# EAGLE design simple_eq_5532 (EAGLE 6.5.0)
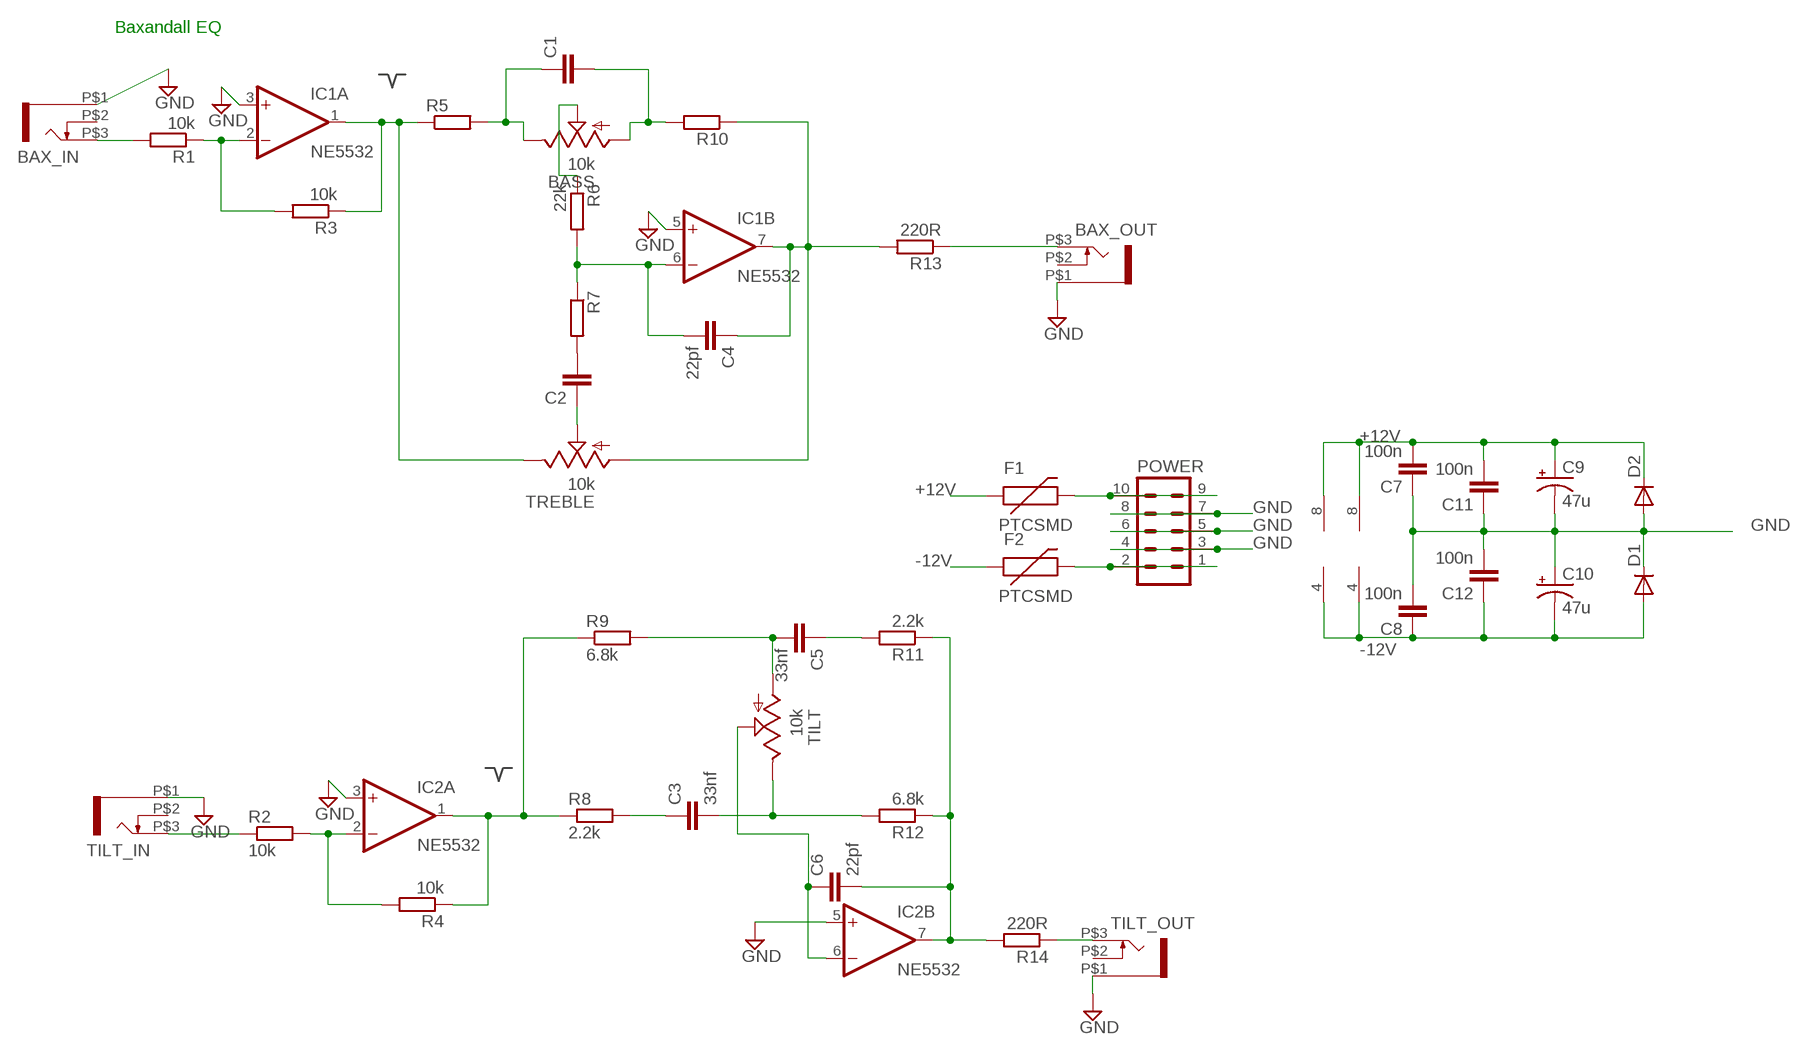
[diagram p0: schematic, sheet 1]

## Parts
BASS  10k  ALPHA-9MMF2A  [EVUF]
BAX_IN  THONKICONN  [THONKICONN]
BAX_OUT  THONKICONN  [THONKICONN]
C1  C-EU0805_CAP  [R0805]
C2  C-EU0805_CAP  [R0805]
C3  33nf  C-EU0805_CAP  [R0805]
C4  22pf  C-EU0805_CAP  [R0805]
C5  33nf  C-EU0805_CAP  [R0805]
C6  22pf  C-EU0805_CAP  [R0805]
C7  100n  C-EU0805_CAP  [R0805]
C8  100n  C-EU0805_CAP  [R0805]
C9  47u  CPOL-USD  [PANASONIC_D]
C10  47u  CPOL-USD  [PANASONIC_D]
C11  100n  C-EU0805_CAP  [R0805]
C12  100n  C-EU0805_CAP  [R0805]
D1  DIODE-SOD123  [SOD123]
D2  DIODE-SOD123  [SOD123]
F1  PTCSMD  [PTC-1206]
F2  PTCSMD  [PTC-1206]
IC1  NE5532  TL072D  [SO08]
IC2  NE5532  TL072D  [SO08]
POWER  10_PIN_HEADER  [MA05-2]
R1  10k  R-EU_R0805  [R0805]
R2  10k  R-EU_R0805  [R0805]
R3  10k  R-EU_R0805  [R0805]
R4  10k  R-EU_R0805  [R0805]
R5  R-EU_R0805  [R0805]
R6  22k  R-EU_R0805  [R0805]
R7  R-EU_R0805  [R0805]
R8  2.2k  R-EU_R0805  [R0805]
R9  6.8k  R-EU_R0805  [R0805]
R10  R-EU_R0805  [R0805]
R11  2.2k  R-EU_R0805  [R0805]
R12  6.8k  R-EU_R0805  [R0805]
R13  220R  R-EU_R0805  [R0805]
R14  220R  R-EU_R0805  [R0805]
TILT  10k  ALPHA-9MMF2A  [EVUF]
TILT_IN  THONKICONN  [THONKICONN]
TILT_OUT  THONKICONN  [THONKICONN]
TREBLE  10k  ALPHA-9MMF2A  [EVUF]

## Nets
+12V [power]: C7.2 C9.+ C11.2 D2.C F1.1 IC1.8(P:V+) IC2.8(P:V+)
-12V [power]: C8.1 C10.- C12.1 D1.A F2.1 IC1.4(P:V-) IC2.4(P:V-)
BAX1: C4.1 IC1.7(B:OUT) R10.1 R13.2 TREBLE.1(A)
BAX$1: BAX_IN.P$3 R1.2
BAX$2: BAX_OUT.P$3 R13.1
BAX$24: IC1.2(A:-IN) R1.1 R3.2
BAX$26: C2.1 TREBLE.2(S)
BAX$27: BASS.3(E) C1.1 R5.2
BAX$28: BASS.1(A) C1.2 R10.2
BAX$29: BASS.2(S) R6.1
BAX$31: IC1.1(A:OUT) R3.1 R5.1 TREBLE.3(E)
BAX$32: C4.2 IC1.6(B:-IN) R6.2 R7.1
GND [ground]: BAX_IN.P$1 BAX_OUT.P$1 C7.1 C8.2 C9.- C10.+ C11.1 C12.2 D1.C D2.A IC1.3(A:+IN) IC1.5(B:+IN) IC2.3(A:+IN) IC2.5(B:+IN) POWER.3 POWER.4 POWER.5 POWER.6 POWER.7 POWER.8 TILT_IN.P$1 TILT_OUT.P$1
N$3: IC2.2(A:-IN) R2.2 R4.2
N$4: IC2.1(A:OUT) R4.1 R8.1 R9.1
N$5: R14.1 TILT_OUT.P$3
N$6: R2.1 TILT_IN.P$3
N$7: F1.2 POWER.9 POWER.10
N$8: F2.2 POWER.1 POWER.2
N$13: C3.1 R8.2
N$16: C3.2 R12.2 TILT.3(E)
N$18: C5.2 R9.2 TILT.1(A)
N$21: C5.1 R11.2
N$22: C6.1 IC2.6(B:-IN) TILT.2(S)
N$25: C2.2 R7.2
TILT_OUT: C6.2 IC2.7(B:OUT) R11.1 R12.1 R14.2
Unconnected: BAX_IN.P$2 BAX_OUT.P$2 TILT_IN.P$2 TILT_OUT.P$2

## Notes on the sheet
- Baxandall EQ

## Library data of the parts
BASS TILT TREBLE = TomW:ALPHA-9MM: 9 mm Square Rotary Potentiometers Source: Panasonic
BAX_IN BAX_OUT TILT_IN TILT_OUT = TomW:THONKICONN
C1-C8 C11 C12 = TomW:C-EU: CAPACITOR, European symbol
C9 C10 = rcl:CPOL-US: POLARIZED CAPACITOR, American symbol
D1 D2 = diode:DIODE-: DIODE
F1 F2 = SparkFun-PowerIC:PTC: Resettable Fuse PTC Resettable Fuse. Spark Fun Electronics SKU : COM-08357; PROD_ID: RES-11150
IC1 IC2 = TomW:TL072: OP AMP
POWER = TomW:10_PIN_HEADER: PIN HEADER; OC_FARNELL: unknown; OC_NEWARK: unknown
R1-R14 = TomW:R-EU_: RESISTOR, European symbol

## Net classes
0 default: width 0.305 mm
2 ground: width 0.305 mm
3 power: width 0.305 mm

## Board
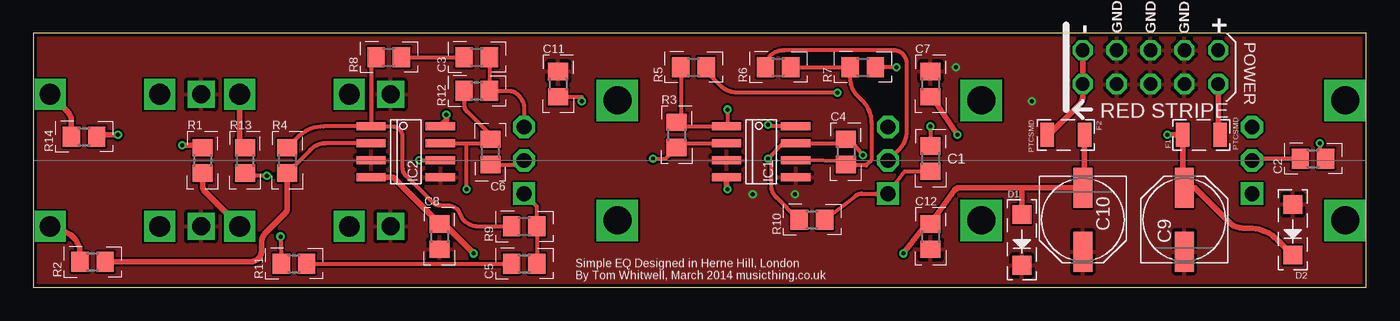
[diagram p1: board, top side]
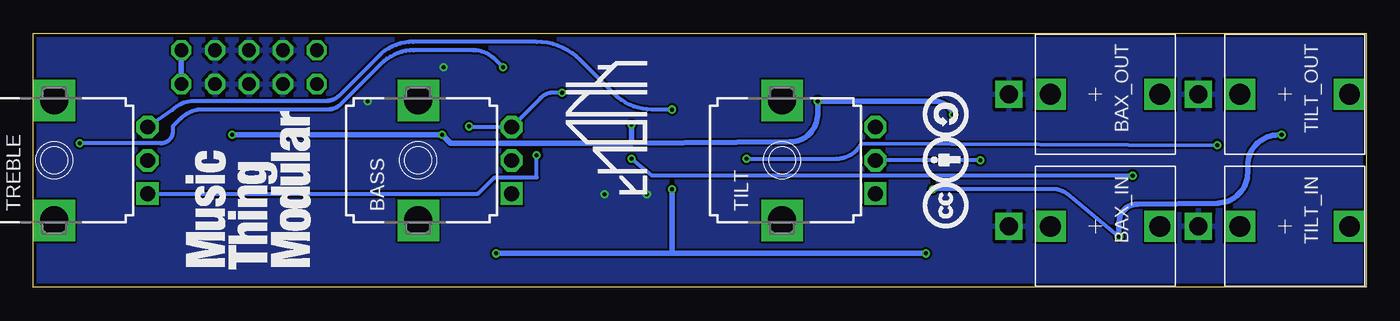
[diagram p2: board, bottom side, seen from below]

Size 100 x 19.05 mm. Coordinates in mm from the lower left corner, seen from the top.
Outline: 0,0 100,0 100,19.05 0,19.05 0,0
Copper layers (1*2*15*16): Top 0.035mm / dielectric 0.2mm / Route2 0.0175mm / dielectric 1.1mm / Route15 0.0175mm / dielectric 0.2mm / Bottom 0.035mm
Design rules "SeeedStudio_DRU_no_angle_20130527": minimum track width 6mil, minimum drill 12mil, track to track 6mil, track to pad 6mil, pad to pad 6mil, via to via 6mil, smd to smd 0mil, copper to edge 10mil, drill to drill 10mil, minimum pad ring 6mil, minimum via ring 6mil, stop-mask expansion 2mil, vias tented up to drill 25mil, thermal gap 10mil

### Footprints (pad centres in the part's own frame; a part is rotated, then mirrored left to right if it is on the bottom)
EVUF = drill 1.1 pad 1.676 square: 1 -2.5,-7 | drill 1.1 pad 1.676 octagon: 2 0,-7; 3 2.5,-7 | drill 2.1 pad 2.8 square: M1 4.5,0; M2 -4.5,0
THONKICONN = drill 1.35 square: P$1 0,-6.48 | drill 1.55 square: P$2 0,-3.38; P$3 0,4.84
R0805 = smd 1.3 x 1.5: 1 -0.95,0; 2 0.95,0
PANASONIC_D = smd 3 x 1.4: + 2.4,0; - -2.4,0
SOD123 = smd 1.4 x 1.4: A 1.9,0; C -1.9,0
PTC-1206 = smd 1 x 1.8: 1 -1.4,0; 2 1.4,0
SO08 = smd 0.6 x 2.2: 1 -1.905,-2.6; 2 -0.635,-2.6; 3 0.635,-2.6; 4 1.905,-2.6; 5 1.905,2.6; 6 0.635,2.6; 7 -0.635,2.6; 8 -1.905,2.6
MA05-2 = drill 1.016 octagon: 1 -5.08,-1.27; 2 -5.08,1.27; 3 -2.54,-1.27; 4 -2.54,1.27; 5 0,-1.27; 6 0,1.27; 7 2.54,-1.27; 8 2.54,1.27; 9 5.08,-1.27; 10 5.08,1.27

### Placement (x,y rotation side)
BASS  71.12,9.53 90 bottom
BAX_IN  20.32,4.57 270 bottom
BAX_OUT  20.32,14.48 270 bottom
C1  67.31,9.65 270 top
C2  96.01,9.65 0 top
C3  33.27,17.27 0 top
C4  60.96,10.16 270 top
C5  36.83,1.78 0 top
C6  34.29,10.16 90 top
C7  67.31,15.24 270 top
C8  30.48,3.81 270 top
C9  86.36,5.08 90 top
C10  78.74,5.08 270 top
C11  39.37,15.24 270 top
C12  67.31,3.81 270 top
D1  74.17,3.56 90 top
D2  94.49,4.32 90 top
F1  87.63,11.43 0 top
F2  77.47,11.43 180 top
IC1  54.61,10.16 270 top
IC2  27.94,10.16 270 top
POWER  83.82,16.51 0 top
R1  12.7,9.53 270 top
R2  4.45,1.91 0 top
R3  48.26,11.43 270 top
R4  19.05,9.53 270 top
R5  49.53,16.51 0 top
R6  55.88,16.51 0 top
R7  62.23,16.51 0 top
R8  26.67,17.27 0 top
R9  36.83,4.57 0 top
R10  58.42,5.08 0 top
R11  19.56,1.78 0 top
R12  33.27,14.73 0 top
R13  15.88,9.53 270 top
R14  3.81,11.3 0 top
TILT  43.81,9.53 90 bottom
TILT_IN  6.1,4.57 270 bottom
TILT_OUT  6.1,14.48 270 bottom
TREBLE  98.42,9.53 90 bottom
U$5  [MTM_1CM]  78.74,1.27 90 bottom
U$6  [CC_1CM_SCREENPRINT]  29.84,4.45 90 bottom
U$7  [THONK_1CM_SCREENPRINT]  53.98,6.99 90 bottom

### Tracks (layer width: path | path; a pad name or v marks a point on that pad's centre or on a via)
+12V  (via drill 0.3)
  Top 0.305: C11.2 41.15,14.29 v41.15,13.97 | 57.21,12.19 IC1.8 55.12,12.06 v55.12,12.19
  Top 0.406: v85.09,11.43 F1.1 86.23,7.61 C9.+ 87.14,7.48 89.75,4.86 arc45 90.76,4.45 91.2,4.45 arc-45 93.35,3.56 D2.C | v69.34,11.43 67.63,13.97 C7.2 | v30.99,12.95 30.99,12.51 IC2.8
  Bottom 0.305: v55.12,12.19 | v30.99,12.95 30.99,13.21
  Bottom 0.406: v85.09,11.43 v69.34,11.43 68.71,10.79 55.12,10.79 | 55.12,10.79 43.22,10.9 arc-89 41.15,13 v41.15,13.97 32.49,13.97 arc45 31.22,13.44 30.99,13.21 | v55.12,12.19 55.12,10.79
-12V  (via drill 0.3)
  Top 0.305: C12.1 66.99,4.76 | C8.1 30.8,4.76 | v52.07,7.37 52.01,7.37
  Top 0.406: F2.1 78.87,7.61 C10.- 74.17,7.48 | 74.17,7.48 69.52,7.48 arc54 69.12,7.27 C12.1 | D1.A 74.17,7.48 | 66.99,4.76 v65.28,2.54 | 30.8,4.76 v33.02,2.54 | 52.01,7.37 IC1.4 | IC2.4 26.98,8.26 C8.1
  Bottom 0.406: v33.02,2.54 52.07,2.54 | 52.07,2.54 v65.28,2.54 | v52.07,7.37 52.07,2.54
BAX1  (via drill 0.3)
  Top 0.305: R10.1 57.4,5.08 55.74,6.75 arc-45 55.37,7.63 55.37,9.4 v55.12,9.65 56.26,10.79 IC1.7 60.65,10.79 C4.1 61.28,11.11 v62.23,9.91 | v17.53,8.38 15.88,8.38 R13.2
  Bottom 0.305: v17.53,8.38 53.59,8.38 v55.12,9.65 | TREBLE.1 66.64,7.03 65.41,8.26 62.23,8.26 v62.23,9.91
BAX$1
  Top 0.406: R1.2 12.7,7.64 arc45 12.9,7.15 BAX_IN.P$3
BAX$2
  Top 0.406: BAX_OUT.P$3 15.48,10.87 R13.1
BAX$24  (via drill 0.3)
  Top 0.305: v46.48,9.65 47.43,9.65 R3.2 48.26,10.79 IC1.2
  Top 0.406: v11.18,10.67 12.51,10.67 R1.1
  Bottom 0.305: v46.48,9.65 39.74,9.65 arc-45 38.24,10.27 37.85,10.79 v11.18,10.67
BAX$26
  Top 0.305: C2.1 91.55,9.65 TREBLE.2
BAX$27  (via drill 0.3)
  Top 0.305: 50.8,16.51 R5.2 50.8,16.19 50.8,15.88 51.54,15.13 arc45 52.81,14.61 v60.33,14.61 | v67.31,12.06 C1.1
  Bottom 0.305: v67.31,12.06 67.27,12.03 BASS.3 61.95,14.2 arc45 60.96,14.61 v60.33,14.61
BAX$28
  Top 0.305: R10.2 61.71,6.87 arc-37 62.16,7.03 BASS.1 65.39,8.7 C1.2
BAX$29
  Top 0.305: BASS.2 64.14,9.53 65,10.39 arc45 65.53,11.67 65.53,16.79 arc90 64.54,17.78 56.35,17.78 arc45 55.23,17.32 R6.1
BAX$31  (via drill 0.3)
  Top 0.305: R5.1 48.58,12.38 R3.1 48.26,12.06 IC1.1 52.07,12.12 v52.07,13.34
  Bottom 0.305: v52.07,13.34 53.58,13.34 arc45 56.42,14.51 58.97,17.06 arc-45 62.24,18.41 71.49,18.41 arc-45 74.11,17.33 77.05,14.39 arc45 78.06,13.97 87.94,13.97 arc-45 89.55,13.3 TREBLE.3
BAX$32
  Top 0.305: C4.2 61.03,9.14 62.48,9.14 62.87,9.53 62.87,12.39 arc45 62.19,14.01 61.82,14.38 arc-45 61.28,15.69 R7.1 R6.2 | C4.2 60.96,8.89 | C4.2 60.89,9.46 57.78,9.53 IC1.6
GND  (via drill 0.3)
  other vias: 53.98,6.99 57.15,6.99 74.93,13.97 69.22,16.51
  pour Bottom: 106.68,23.5 106.68,-6.99 -1.91,-6.99 -1.91,23.5
  pour Top: -2.54,20.32 104.14,20.32 104.14,-3.81 -2.54,-3.81
N$3
  Top 0.305: IC2.2 21.93,10.79 arc45 20.8,10.33 R4.2
  Top 0.406: R4.2 19.05,5.98 arc-45 18.86,5.53 17.41,4.07 arc45 17.14,3.44 17.14,2.8 arc-90 16.25,1.91 R2.2
N$4
  Top 0.305: IC2.1 26.95,12.06 arc-90 27.69,11.32 27.69,9.02 arc45 27.96,8.37 30.03,6.29 arc38 30.55,6.17 31.12,6.15 arc-37 31.89,5.79 32.22,5.1 arc44 33.34,4.57 R9.1 | R8.1 25.34,17.27 IC2.1 | IC2.1 21.76,12.06 arc45 19.85,11.27 R4.1
N$5
  Top 0.406: R14.1 2.86,12.47 arc45 2.58,13.16 TILT_OUT.P$3
N$6
  Top 0.406: R2.1 3.5,2.57 arc70 2.38,4.17 TILT_IN.P$3
N$7
  Top 0.406: POWER.9 88.9,11.56 F1.2
  Bottom 0.406: POWER.10 POWER.9
N$8
  Top 0.406: POWER.2 POWER.1 78.74,14.34 arc-45 78.48,13.71 76.2,11.43 F2.2
N$13
  Top 0.305: R8.2 C3.1
N$16
  Top 0.305: C3.2 R12.2 35.69,14.73 arc-45 36.34,14.46 36.41,14.39 arc-45 36.83,13.38 36.83,12.04 TILT.3
N$18
  Top 0.305: C5.2 R9.2 37.78,6.06 TILT.1
N$21
  Top 0.305: R11.2 C5.1
N$22  (via drill 0.3)
  Top 0.305: v28.96,9.53 IC2.6 | C6.1 36.5,9.21 TILT.2
  Bottom 0.305: v28.96,9.53 TILT.2
N$25  (via drill 0.3)
  Top 0.305: v64.77,16.51 R7.2 | v96.52,10.79 96.52,10.09 C2.2
  Bottom 0.305: v64.77,16.51 65.37,17.11 arc-45 66.99,17.78 71.45,17.78 arc-45 73.92,16.75 76.97,13.71 arc45 77.87,13.34 87.32,13.34 arc-45 88.94,12.66 89.53,12.06 89.53,11.69 arc90 90.43,10.79 v96.52,10.79
TILT_OUT  (via drill 0.3)
  Top 0.305: R12.1 32.32,13.69 arc45 32.53,13.19 34.29,11.43 C6.2 34.29,10.79 32.51,10.79 | v18.54,3.81 R11.1 | v32.51,7.37 32.51,10.79 | IC2.7 32.51,10.79
  Top 0.406: v6.35,11.43 4.76,11.43 R14.2
  Bottom 0.305: v18.54,3.81 22.37,6.96 arc-39 23.5,7.37 v32.51,7.37
  Bottom 0.406: v6.35,11.43 6.6,11.43 arc-90 8.89,9.14 8.89,8.61 arc89 11.15,6.32 17.19,6.24 arc-89 18.54,4.87 v18.54,3.81

### Text on the board
tPlace: Simple EQ Designed in Herne Hill, London / By Tom Whitwell, March 2014 musicthing.co.uk